# EasyEDA schematic SCH_SEEK-993-001_v1_00.json
TITLE: SEEK Shield for XBee to RYLR993; REV: 1.00; Date: 2023-02-13; Sheet: 1/1; Drawn By: c4m0ufl4g3; Company: Injectyll-HIDe
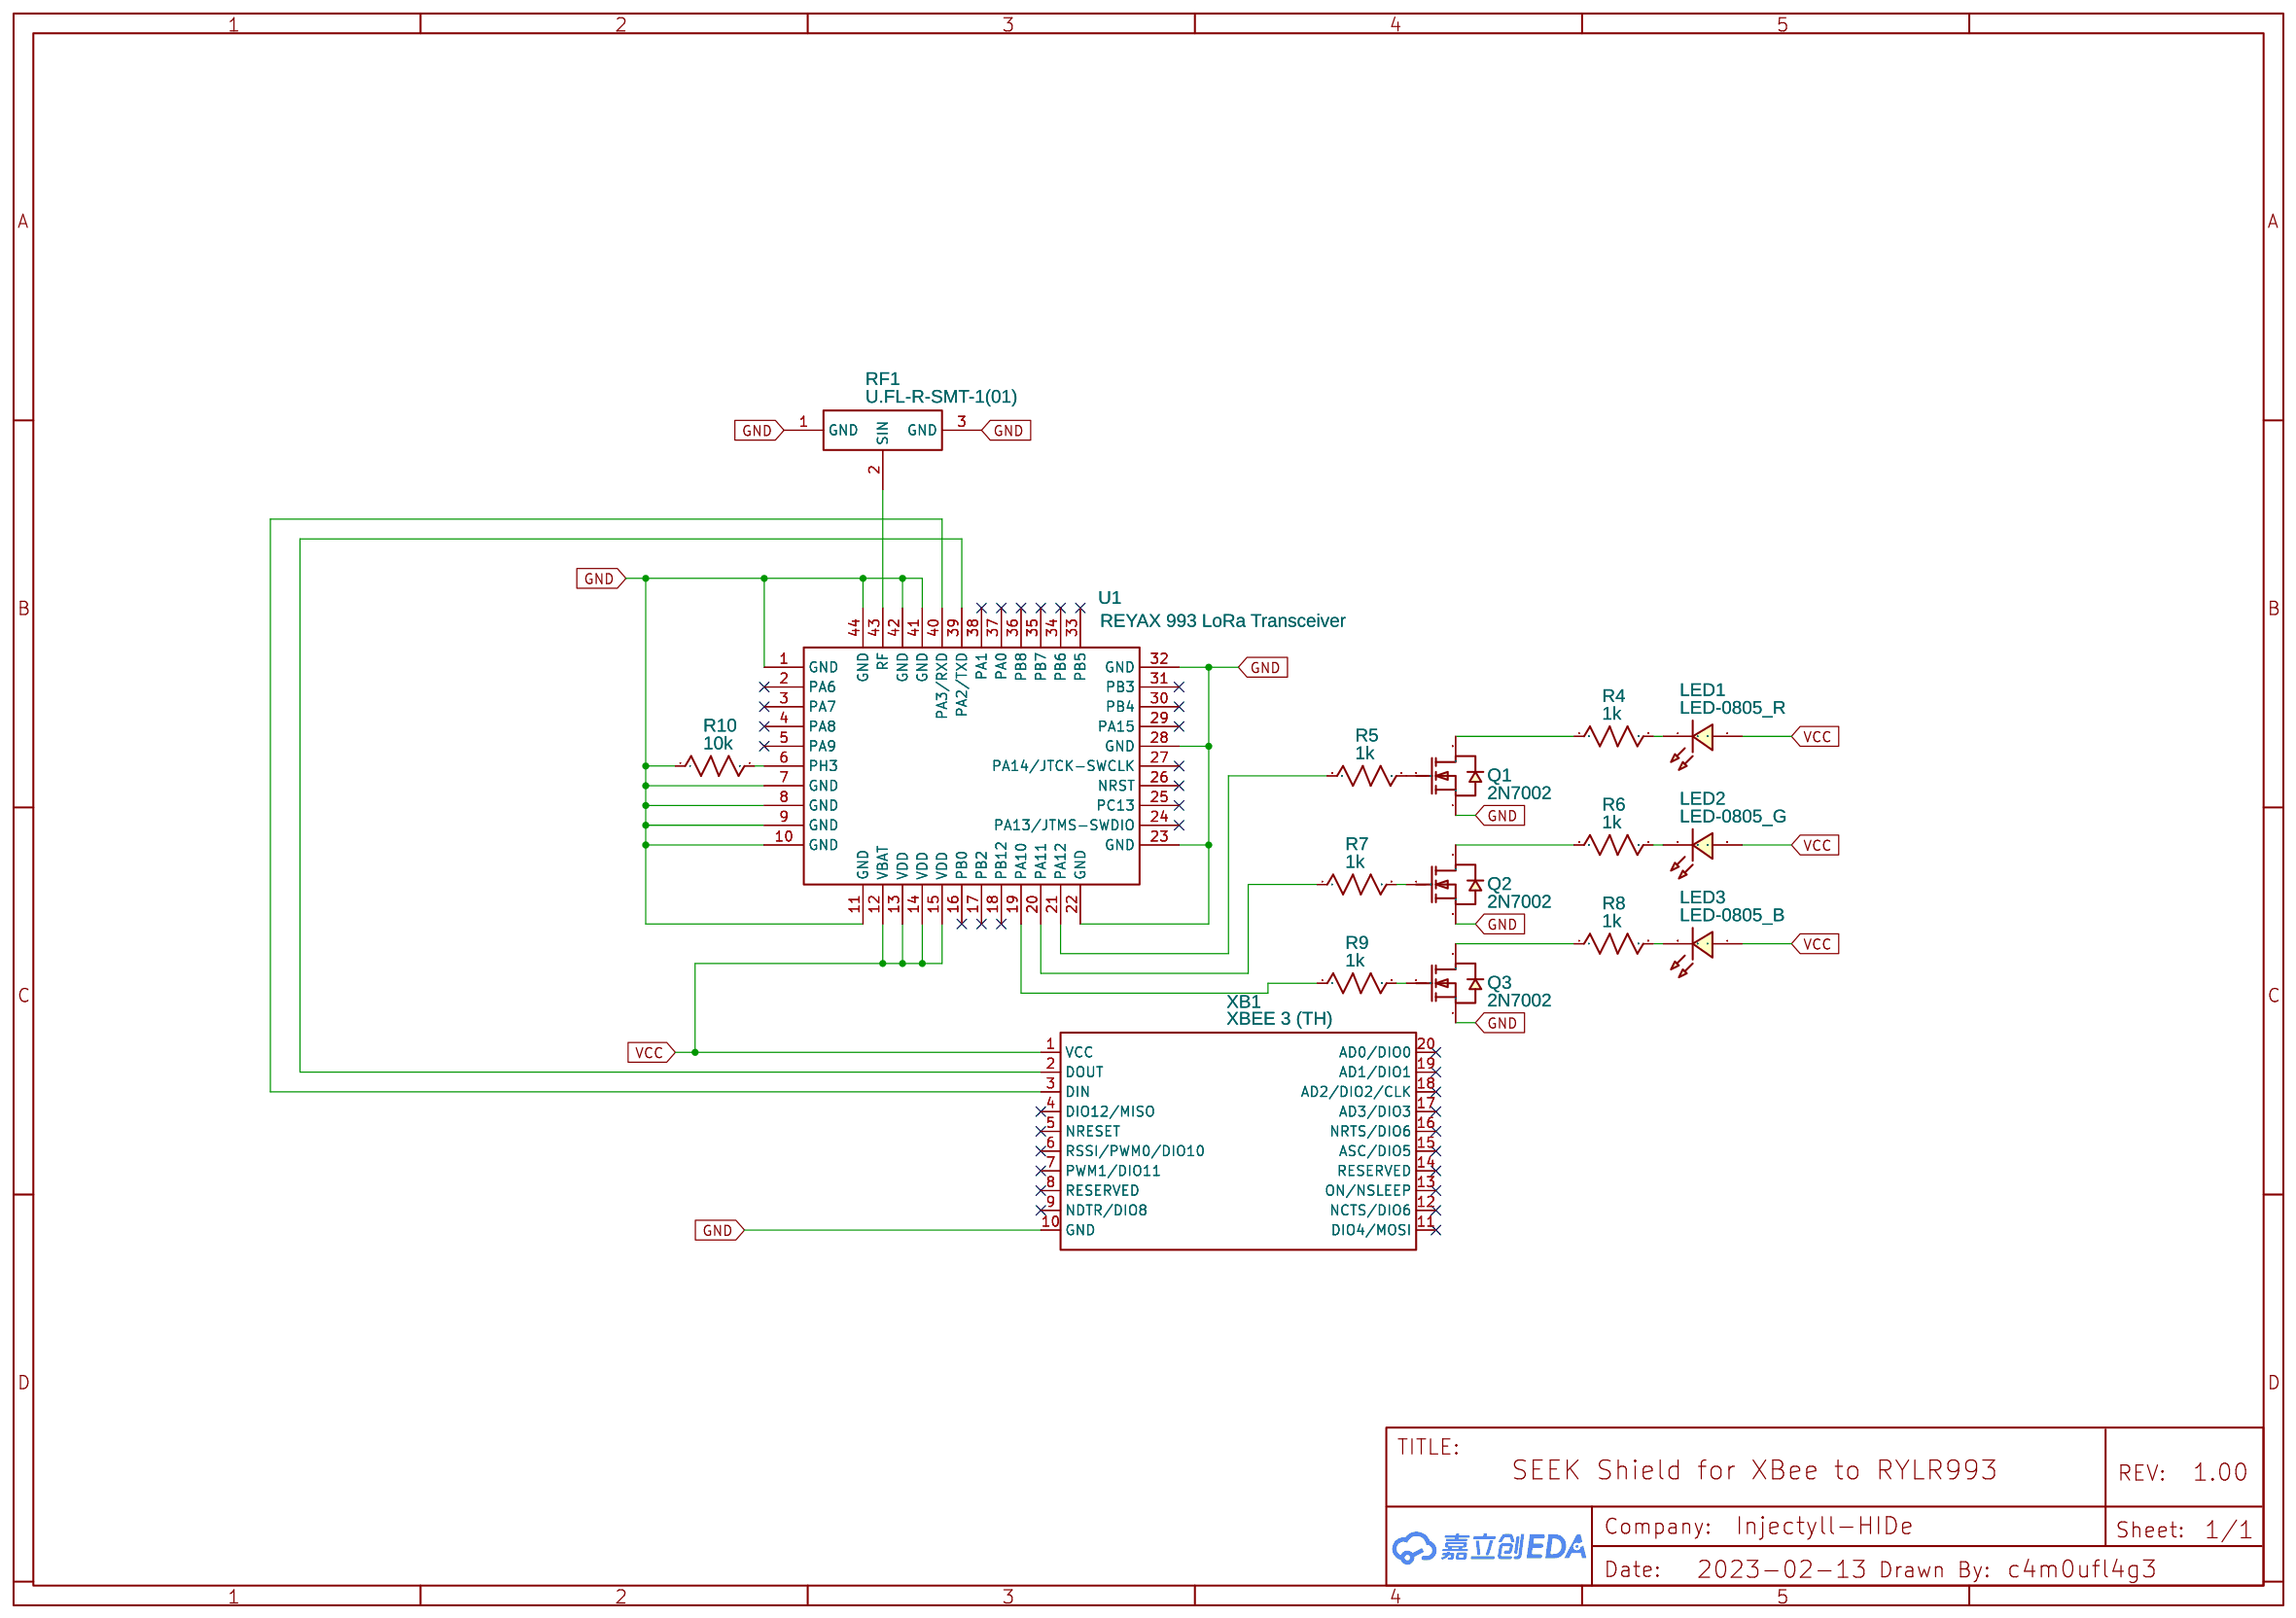
[diagram p0: schematic sheet]

## Parts
LED1  LED-0805_R  [LED0805_RED]
LED2  LED-0805_G  [LED0805_GREEN]
LED3  LED-0805_B  [LED0805_BLUE]
Q1  2N7002  [SOT-23_L2.9-W1.3-P0.95-LS2.4-BR]
Q2  2N7002  [SOT-23_L2.9-W1.3-P0.95-LS2.4-BR]
Q3  2N7002  [SOT-23_L2.9-W1.3-P0.95-LS2.4-BR]
R4  1k  [R0402]
R5  1k  [R0402]
R6  1k  [R0402]
R7  1k  [R0402]
R8  1k  [R0402]
R9  1k  [R0402]
R10  10k  [R0402]
RF1  U.FL-R-SMT-1(01)  [RF-SMD_U.FL-R-SMT-1-80]
U1  REYAX 993 LoRa Transceiver  [RYLR993]
XB1  XBEE 3 (TH)  [XBEE 3 (TH)]

## Library data of the parts
LED1 = LED-0805_R: Manufacturer: EVERLIGHT(台湾亿光); Manufacturer Part: 17-21SURC/S530-A3/TR8; Supplier Part: C72037; Contributor: LCEDA_Lib
LED2 = LED-0805_G: Manufacturer: 国星光电; Manufacturer Part: NCD0805G1; Supplier Part: C84260; Contributor: LCEDA_Lib
LED3 = LED-0805_B: Manufacturer: 方舟 ARKLED; Manufacturer Part: D-B080508B1-KS2; Supplier Part: C108412; Contributor: LCEDA_Lib
Q1-Q3 = 2N7002: Supplier: LCSC; Manufacturer: Nexperia; Manufacturer Part: 2N7002,215; image: //image.lceda.cn/szlcsc/C65189.jpg; Supplier Part: C65189; Paste Type: expand; Contributor: LCEDA_Lib
R4-R10 = R_0402_US: Contributor: LCEDA_Lib
RF1 = U.FL-R-SMT-1(01): Supplier: LCSC; Supplier Part: C598199; Manufacturer: HRS(广濑); Contributor: LCSC; JLCPCB Part Class: Extended Part
U1 = REYAX 993 LoRa Transceiver: Manufacturer: REYAX; link: https://reyax.com//products/RYLR993; Contributor: c4m0ufl4g3
XB1 = XBEE 3 (TH): Manufacturer: Digi; link: https://www.digi.com/products/embedded-systems/digi-xbee/rf-modules/2-4-ghz-rf-modules/xbee3-zigbee-3#productsupport; Contributor: MEBenz

## Nets
GND: Q1.2(S) Q2.2(S) Q3.2(S) R10.1 RF1.1(GND) RF1.3(GND) U1.1(GND) U1.7(GND) U1.8(GND) U1.9(GND) U1.10(GND) U1.11(GND) U1.22(GND) U1.23(GND) U1.28(GND) U1.32(GND) U1.41(GND) U1.42(GND) U1.44(GND) XB1.10(GND)
VCC: LED1.1 LED2.1 LED3.1 U1.12(VBAT) U1.13(VDD) U1.14(VDD) U1.15(VDD) XB1.1(VCC)
Net-(LED1-2): LED1.2 R4.2
Net-(LED2-2): LED2.2 R6.2
Net-(LED3-2): LED3.2 R8.2
Net-(Q1-1): Q1.1(G) R5.2
Net-(Q1-3): Q1.3(D) R4.1
Net-(Q2-1): Q2.1(G) R7.2
Net-(Q2-3): Q2.3(D) R6.1
Net-(Q3-1): Q3.1(G) R9.2
Net-(Q3-3): Q3.3(D) R8.1
Net-(R5-1): R5.1 U1.21(PA12)
Net-(R7-1): R7.1 U1.20(PA11)
Net-(R9-1): R9.1 U1.19(PA10)
Net-(R10-2): R10.2 U1.6(PH3)
Net-(RF1-2): RF1.2(SIN) U1.43(RF)
Net-(U1-39): U1.39(PA2/TXD) XB1.2(DOUT)
Net-(U1-40): U1.40(PA3/RXD) XB1.3(DIN)

Not connected (* = marked no-connect by the designer): U1 2(PA6)* 3(PA7)* 4(PA8)* 5(PA9)* 16(PB0)* 17(PB2)* 18(PB12)* 24(PA13/JTMS-SWDIO)* 25(PC13)* 26(NRST)* 27(PA14/JTCK-SWCLK)* 29(PA15)* 30(PB4)* 31(PB3)* 33(PB5)* 34(PB6)* 35(PB7)* 36(PB8)* 37(PA0)* 38(PA1)*; XB1 4(DIO12/MISO)* 5(NRESET)* 6(RSSI/PWM0/DIO10)* 7(PWM1/DIO11)* 8(RESERVED)* 9(NDTR/DIO8)* 11(DIO4/MOSI)* 12(NCTS/DIO6)* 13(ON/NSLEEP)* 14(RESERVED)* 15(ASC/DIO5)* 16(NRTS/DIO6)* 17(AD3/DIO3)* 18(AD2/DIO2/CLK)* 19(AD1/DIO1)* 20(AD0/DIO0)*
